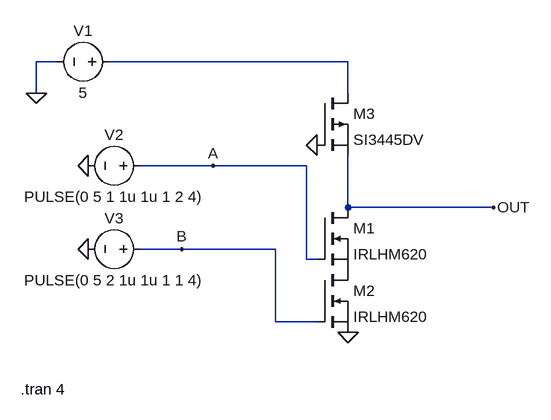
[diagram p0: schematic NAND PSEUDO.asc]
NAND PSEUDO.asc, the LTspice schematic file:
Version 4.1
SHEET 1 880 680
WIRE -128 -16 -160 -16
WIRE 320 -16 -48 -16
WIRE -160 32 -160 -16
WIRE 320 32 320 -16
WIRE 112 144 0 144
WIRE 256 144 112 144
WIRE 320 208 320 128
WIRE 544 208 320 208
WIRE 64 272 0 272
WIRE 208 272 64 272
WIRE 256 288 256 144
WIRE 272 288 256 288
WIRE 208 384 208 272
WIRE 272 384 208 384
FLAG -160 32 0
FLAG -80 144 0
FLAG -80 272 0
FLAG 112 144 A
FLAG 64 272 B
FLAG 544 208 OUT
FLAG 272 112 0
FLAG 320 400 0
SYMBOL voltage -32 -16 R90
WINDOW 0 -32 56 VBottom 2
WINDOW 3 32 56 VTop 2
WINDOW 123 0 0 Left 0
WINDOW 39 0 0 Left 0
SYMATTR InstName V1
SYMATTR Value 5
SYMBOL voltage 16 144 R90
WINDOW 0 -32 56 VBottom 2
WINDOW 3 32 56 VTop 2
WINDOW 123 0 0 Left 0
WINDOW 39 0 0 Left 0
SYMATTR InstName V2
SYMATTR Value PULSE(0 5 1 1u 1u 1 2 4)
SYMBOL voltage 16 272 R90
WINDOW 0 -32 56 VBottom 2
WINDOW 3 32 56 VTop 2
WINDOW 123 0 0 Left 0
WINDOW 39 0 0 Left 0
SYMATTR InstName V3
SYMATTR Value PULSE(0 5 2 1u 1u 1 1 4)
SYMBOL pmos 272 32 R0
SYMATTR InstName M3
SYMATTR Value SI3445DV
SYMBOL nmos 272 208 R0
SYMATTR InstName M1
SYMATTR Value IRLHM620
SYMBOL nmos 272 304 R0
SYMATTR InstName M2
SYMATTR Value IRLHM620
TEXT -184 488 Left 2 !.tran 4

The netlist it stands for:
* NAND PSEUDO.asc
V1 N001 0 5
V2 A 0 PULSE(0 5 1 1u 1u 1 2 4)
V3 B 0 PULSE(0 5 2 1u 1u 1 1 4)
M3 N001 0 OUT OUT SI3445DV
M1 OUT A P001 P001 IRLHM620
M2 P001 B 0 0 IRLHM620
.model NMOS NMOS
.model PMOS PMOS
.lib standard.mos
.tran 4
.backanno
.end